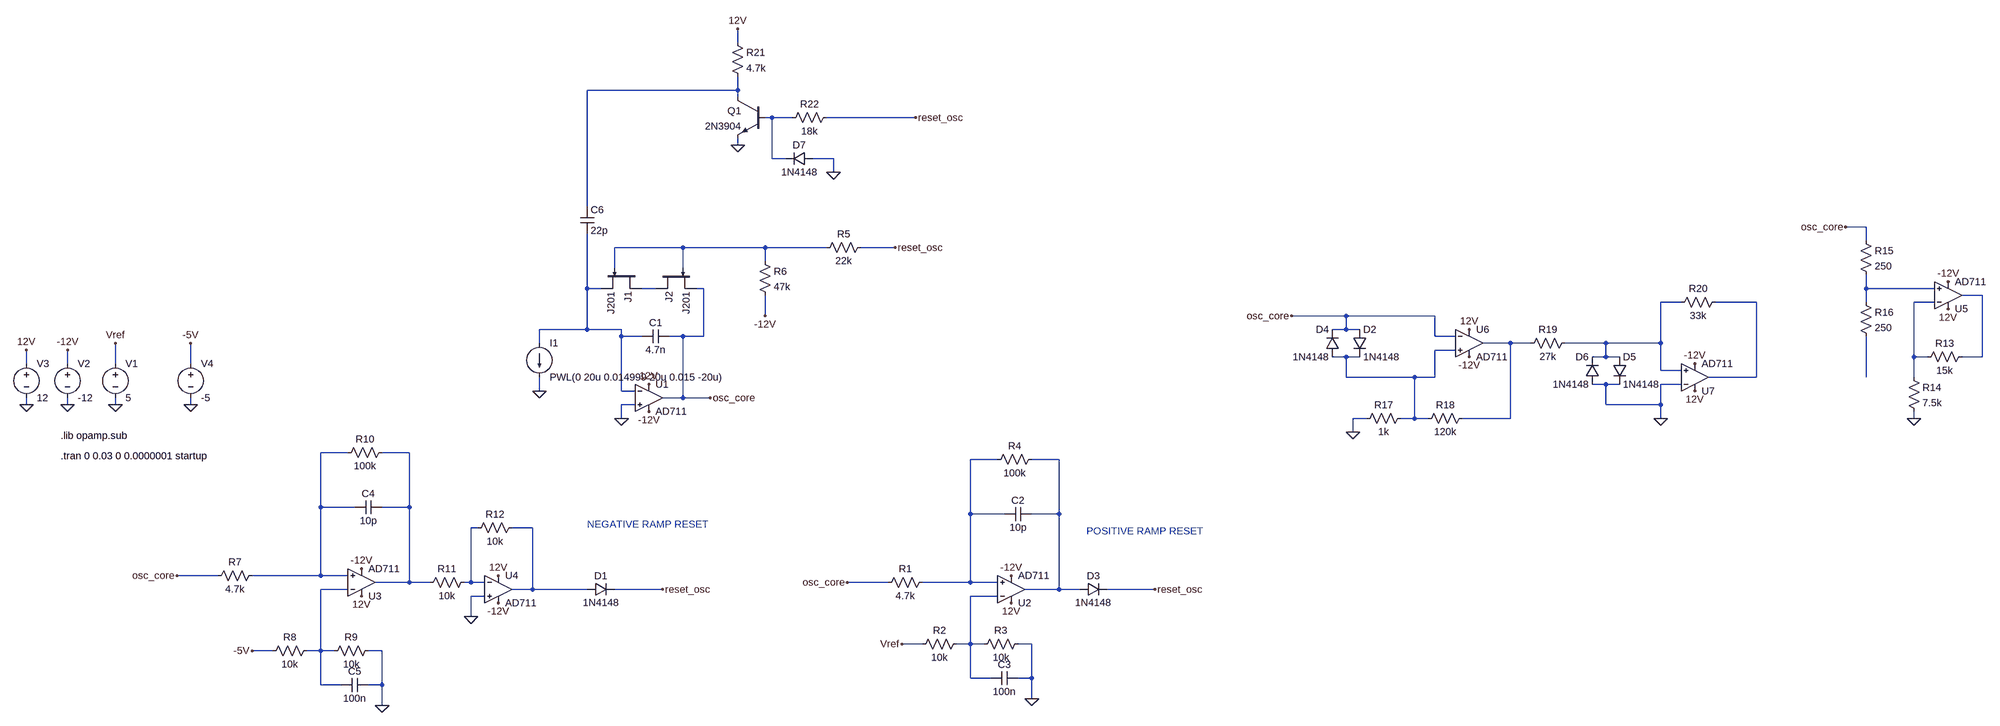
[diagram p0: schematic oscillator core.asc]
oscillator core.asc, the LTspice schematic file:
Version 4.1
SHEET 1 3296 1204
WIRE 208 -592 208 -624
WIRE 208 -480 208 -512
WIRE 208 -480 -144 -480
WIRE 208 -464 208 -480
WIRE 288 -416 272 -416
WIRE 336 -416 288 -416
WIRE 624 -416 416 -416
WIRE 208 -352 208 -368
WIRE 288 -320 288 -416
WIRE 320 -320 288 -320
WIRE 432 -320 384 -320
WIRE 432 -288 432 -320
WIRE -144 -208 -144 -480
WIRE 3008 -160 2960 -160
WIRE 3008 -128 3008 -160
WIRE 80 -112 -80 -112
WIRE 272 -112 80 -112
WIRE 416 -112 272 -112
WIRE 576 -112 496 -112
WIRE 272 -80 272 -112
WIRE -80 -64 -80 -112
WIRE 80 -64 80 -112
WIRE -144 -16 -144 -144
WIRE -112 -16 -144 -16
WIRE 16 -16 -16 -16
WIRE 128 -16 112 -16
WIRE 3008 -16 3008 -48
WIRE 3168 -16 3008 -16
WIRE 3280 0 3232 0
WIRE 2512 16 2464 16
WIRE 2688 16 2592 16
WIRE 3008 16 3008 -16
WIRE 3168 16 3120 16
WIRE 272 48 272 0
WIRE 1728 48 1600 48
WIRE 1936 48 1728 48
WIRE -144 80 -144 -16
WIRE -144 80 -256 80
WIRE -64 80 -144 80
WIRE 1728 80 1728 48
WIRE 1728 80 1696 80
WIRE 1760 80 1728 80
WIRE -64 96 -64 80
WIRE -16 96 -64 96
WIRE 80 96 48 96
WIRE 128 96 128 -16
WIRE 128 96 80 96
WIRE 1936 96 1936 48
WIRE 1984 96 1936 96
WIRE -256 112 -256 80
WIRE 2112 112 2048 112
WIRE 2160 112 2112 112
WIRE 2336 112 2240 112
WIRE 2464 112 2464 16
WIRE 2464 112 2336 112
WIRE 1984 128 1936 128
WIRE 1728 144 1696 144
WIRE 1760 144 1728 144
WIRE 2336 144 2336 112
WIRE 2336 144 2304 144
WIRE 2368 144 2336 144
WIRE 3120 144 3120 16
WIRE 3152 144 3120 144
WIRE 3280 144 3280 0
WIRE 3280 144 3232 144
WIRE -1456 160 -1456 128
WIRE -1360 160 -1360 128
WIRE -1248 160 -1248 112
WIRE -1072 160 -1072 112
WIRE 2464 176 2464 112
WIRE 2512 176 2464 176
WIRE 1728 192 1728 144
WIRE 1888 192 1728 192
WIRE 1936 192 1936 128
WIRE 1936 192 1888 192
WIRE 2688 192 2688 16
WIRE 2688 192 2576 192
WIRE 3008 192 3008 96
WIRE 3120 192 3120 144
WIRE 2336 208 2304 208
WIRE 2368 208 2336 208
WIRE 2512 208 2464 208
WIRE -256 224 -256 192
WIRE -64 224 -64 96
WIRE -32 224 -64 224
WIRE 80 240 80 96
WIRE 80 240 32 240
WIRE 144 240 80 240
WIRE -1456 256 -1456 240
WIRE -1360 256 -1360 240
WIRE -1248 256 -1248 240
WIRE -1072 256 -1072 240
WIRE -32 256 -64 256
WIRE 2336 256 2336 208
WIRE 2464 256 2464 208
WIRE 2464 256 2336 256
WIRE -64 288 -64 256
WIRE 1776 288 1744 288
WIRE 1888 288 1888 192
WIRE 1888 288 1856 288
WIRE 1920 288 1888 288
WIRE 2112 288 2112 112
WIRE 2112 288 2000 288
WIRE 2464 288 2464 256
WIRE 3120 288 3120 272
WIRE 1744 320 1744 288
WIRE -704 368 -768 368
WIRE -560 368 -624 368
WIRE 816 384 752 384
WIRE 960 384 896 384
WIRE -768 496 -768 368
WIRE -688 496 -768 496
WIRE -560 496 -560 368
WIRE -560 496 -624 496
WIRE 752 512 752 384
WIRE 832 512 752 512
WIRE 960 512 960 384
WIRE 960 512 896 512
WIRE -400 544 -416 544
WIRE -272 544 -320 544
WIRE -1008 656 -1104 656
WIRE -768 656 -768 496
WIRE -768 656 -928 656
WIRE -704 656 -768 656
WIRE -560 672 -560 496
WIRE -560 672 -640 672
WIRE -512 672 -560 672
WIRE -416 672 -416 544
WIRE -416 672 -432 672
WIRE -384 672 -416 672
WIRE 560 672 464 672
WIRE 752 672 752 512
WIRE 752 672 640 672
WIRE 816 672 752 672
WIRE -704 688 -768 688
WIRE -272 688 -272 544
WIRE -272 688 -320 688
WIRE -144 688 -272 688
WIRE 32 688 -80 688
WIRE 960 688 960 512
WIRE 960 688 880 688
WIRE 1008 688 960 688
WIRE 1184 688 1072 688
WIRE -384 704 -416 704
WIRE 816 704 752 704
WIRE -416 752 -416 704
WIRE 640 816 592 816
WIRE 752 816 752 704
WIRE 752 816 720 816
WIRE 784 816 752 816
WIRE 896 816 864 816
WIRE -880 832 -928 832
WIRE -768 832 -768 688
WIRE -768 832 -800 832
WIRE -736 832 -768 832
WIRE -624 832 -656 832
WIRE 752 896 752 816
WIRE 800 896 752 896
WIRE 896 896 896 816
WIRE 896 896 864 896
WIRE -768 912 -768 832
WIRE -720 912 -768 912
WIRE -624 912 -624 832
WIRE -624 912 -656 912
WIRE 896 944 896 896
WIRE -624 960 -624 912
FLAG -64 288 0
FLAG 0 272 -12V
FLAG 0 208 12V
FLAG 144 240 osc_core
FLAG -1248 256 0
FLAG -1248 112 Vref
FLAG -1456 256 0
FLAG -1360 256 0
FLAG -1456 128 12V
FLAG -1360 128 -12V
FLAG -256 224 0
FLAG -1072 256 0
FLAG -1072 112 -5V
FLAG 272 48 -12V
FLAG 848 656 -12V
FLAG 848 720 12V
FLAG 464 672 osc_core
FLAG 896 944 0
FLAG 592 816 Vref
FLAG -672 640 -12V
FLAG -672 704 12V
FLAG -624 960 0
FLAG -928 832 -5V
FLAG -1104 656 osc_core
FLAG 32 688 reset_osc
FLAG 1184 688 reset_osc
FLAG -352 720 -12V
FLAG -352 656 12V
FLAG -416 752 0
FLAG 3200 -32 -12V
FLAG 3200 32 12V
FLAG 3120 288 0
FLAG 2016 144 -12V
FLAG 2016 80 12V
FLAG 1744 320 0
FLAG 1600 48 osc_core
FLAG 2960 -160 osc_core
FLAG 2544 160 -12V
FLAG 2544 224 12V
FLAG 2464 288 0
FLAG 208 -352 0
FLAG 208 -624 12V
FLAG 432 -288 0
FLAG 576 -112 reset_osc
FLAG 624 -416 reset_osc
SYMBOL cap 48 80 R90
WINDOW 0 0 32 VBottom 2
WINDOW 3 32 32 VTop 2
SYMATTR InstName C1
SYMATTR Value 4.7n
SYMBOL res 512 -128 R90
WINDOW 0 0 56 VBottom 2
WINDOW 3 32 56 VTop 2
SYMATTR InstName R5
SYMATTR Value 22k
SYMBOL OpAmps\\AD711 0 176 R0
SYMATTR InstName U1
SYMBOL res 256 -96 R0
SYMATTR InstName R6
SYMATTR Value 47k
SYMBOL voltage -1248 144 R0
WINDOW 123 0 0 Left 0
WINDOW 39 0 0 Left 0
SYMATTR InstName V1
SYMATTR Value 5
SYMBOL voltage -1360 144 R0
WINDOW 123 0 0 Left 0
WINDOW 39 0 0 Left 0
SYMATTR InstName V2
SYMATTR Value -12
SYMBOL voltage -1456 144 R0
WINDOW 123 0 0 Left 0
WINDOW 39 0 0 Left 0
SYMATTR InstName V3
SYMATTR Value 12
SYMBOL current -256 112 R0
WINDOW 123 0 0 Left 0
WINDOW 39 0 0 Left 0
SYMATTR InstName I1
SYMATTR Value PWL(0 20u 0.014999 20u 0.015 -20u)
SYMBOL voltage -1072 144 R0
WINDOW 123 0 0 Left 0
WINDOW 39 0 0 Left 0
SYMATTR InstName V4
SYMATTR Value -5
SYMBOL njf -16 -64 R90
SYMATTR InstName J1
SYMATTR Value J201
SYMBOL njf 16 -64 M90
SYMATTR InstName J2
SYMATTR Value J201
SYMBOL res 656 656 R90
WINDOW 0 0 56 VBottom 2
WINDOW 3 32 56 VTop 2
SYMATTR InstName R1
SYMATTR Value 4.7k
SYMBOL OpAmps\\AD711 848 752 M180
SYMATTR InstName U2
SYMBOL cap 896 496 R90
WINDOW 0 0 32 VBottom 2
WINDOW 3 32 32 VTop 2
SYMATTR InstName C2
SYMATTR Value 10p
SYMBOL diode 1008 704 R270
WINDOW 0 32 32 VTop 2
WINDOW 3 0 32 VBottom 2
SYMATTR InstName D3
SYMATTR Value 1N4148
SYMBOL res 736 800 R90
WINDOW 0 0 56 VBottom 2
WINDOW 3 32 56 VTop 2
SYMATTR InstName R2
SYMATTR Value 10k
SYMBOL res 880 800 R90
WINDOW 0 0 56 VBottom 2
WINDOW 3 32 56 VTop 2
SYMATTR InstName R3
SYMATTR Value 10k
SYMBOL cap 864 880 R90
WINDOW 0 0 32 VBottom 2
WINDOW 3 32 32 VTop 2
SYMATTR InstName C3
SYMATTR Value 100n
SYMBOL res 912 368 R90
WINDOW 0 0 56 VBottom 2
WINDOW 3 32 56 VTop 2
SYMATTR InstName R4
SYMATTR Value 100k
SYMBOL res -912 640 R90
WINDOW 0 0 56 VBottom 2
WINDOW 3 32 56 VTop 2
SYMATTR InstName R7
SYMATTR Value 4.7k
SYMBOL OpAmps\\AD711 -672 736 M180
SYMATTR InstName U3
SYMBOL cap -624 480 R90
WINDOW 0 0 32 VBottom 2
WINDOW 3 32 32 VTop 2
SYMATTR InstName C4
SYMATTR Value 10p
SYMBOL diode -144 704 R270
WINDOW 0 32 32 VTop 2
WINDOW 3 0 32 VBottom 2
SYMATTR InstName D1
SYMATTR Value 1N4148
SYMBOL res -784 816 R90
WINDOW 0 0 56 VBottom 2
WINDOW 3 32 56 VTop 2
SYMATTR InstName R8
SYMATTR Value 10k
SYMBOL res -640 816 R90
WINDOW 0 0 56 VBottom 2
WINDOW 3 32 56 VTop 2
SYMATTR InstName R9
SYMATTR Value 10k
SYMBOL cap -656 896 R90
WINDOW 0 0 32 VBottom 2
WINDOW 3 32 32 VTop 2
SYMATTR InstName C5
SYMATTR Value 100n
SYMBOL res -608 352 R90
WINDOW 0 0 56 VBottom 2
WINDOW 3 32 56 VTop 2
SYMATTR InstName R10
SYMATTR Value 100k
SYMBOL OpAmps\\AD711 -352 624 R0
SYMATTR InstName U4
SYMBOL res -416 656 R90
WINDOW 0 0 56 VBottom 2
WINDOW 3 32 56 VTop 2
SYMATTR InstName R11
SYMATTR Value 10k
SYMBOL res -304 528 R90
WINDOW 0 0 56 VBottom 2
WINDOW 3 32 56 VTop 2
SYMATTR InstName R12
SYMATTR Value 10k
SYMBOL OpAmps\\AD711 3200 64 M180
SYMATTR InstName U5
SYMBOL res 3248 128 R90
WINDOW 0 0 56 VBottom 2
WINDOW 3 32 56 VTop 2
SYMATTR InstName R13
SYMATTR Value 15k
SYMBOL res 3104 176 R0
SYMATTR InstName R14
SYMATTR Value 7.5k
SYMBOL res 2992 -144 R0
SYMATTR InstName R15
SYMATTR Value 250
SYMBOL res 2992 0 R0
SYMATTR InstName R16
SYMATTR Value 250
SYMBOL OpAmps\\AD711 2016 48 R0
SYMATTR InstName U6
SYMBOL diode 1744 80 R0
SYMATTR InstName D2
SYMATTR Value 1N4148
SYMBOL diode 1712 144 R180
WINDOW 0 24 64 Left 2
WINDOW 3 24 0 Left 2
SYMATTR InstName D4
SYMATTR Value 1N4148
SYMBOL res 1872 272 R90
WINDOW 0 0 56 VBottom 2
WINDOW 3 32 56 VTop 2
SYMATTR InstName R17
SYMATTR Value 1k
SYMBOL res 2016 272 R90
WINDOW 0 0 56 VBottom 2
WINDOW 3 32 56 VTop 2
SYMATTR InstName R18
SYMATTR Value 120k
SYMBOL res 2256 96 R90
WINDOW 0 0 56 VBottom 2
WINDOW 3 32 56 VTop 2
SYMATTR InstName R19
SYMATTR Value 27k
SYMBOL diode 2352 144 R0
SYMATTR InstName D5
SYMATTR Value 1N4148
SYMBOL diode 2320 208 R180
WINDOW 0 24 64 Left 2
WINDOW 3 24 0 Left 2
SYMATTR InstName D6
SYMATTR Value 1N4148
SYMBOL OpAmps\\AD711 2544 256 M180
SYMATTR InstName U7
SYMBOL res 2608 0 R90
WINDOW 0 0 56 VBottom 2
WINDOW 3 32 56 VTop 2
SYMATTR InstName R20
SYMATTR Value 33k
SYMBOL cap -160 -208 R0
SYMATTR InstName C6
SYMATTR Value 22p
SYMBOL res 192 -608 R0
SYMATTR InstName R21
SYMATTR Value 4.7k
SYMBOL npn 272 -464 M0
SYMATTR InstName Q1
SYMATTR Value 2N3904
SYMBOL res 432 -432 R90
WINDOW 0 0 56 VBottom 2
WINDOW 3 32 56 VTop 2
SYMATTR InstName R22
SYMATTR Value 18k
SYMBOL diode 384 -336 R90
WINDOW 0 0 32 VBottom 2
WINDOW 3 32 32 VTop 2
SYMATTR InstName D7
SYMATTR Value 1N4148
TEXT -1376 376 Left 2 !.tran 0 0.03 0 0.0000001 startup
TEXT -1376 328 Left 2 !.lib opamp.sub
TEXT 1024 552 Left 2 ;POSITIVE RAMP RESET
TEXT -144 536 Left 2 ;NEGATIVE RAMP RESET

The netlist it stands for:
* oscillator core.asc
C1 osc_core N004 4.7n
R5 reset_osc N003 22k
X§U1 0 N004 12V -12V osc_core AD712  ; AD711, pins In+ In- V+ V- OUT
R6 N003 -12V 47k
V1 Vref 0 5
V2 -12V 0 -12
V3 12V 0 12
I1 N004 0 PWL(0 20u 0.014999 20u 0.015 -20u)
V4 -5V 0 -5
J1 N005 N003 N004 J201
J2 N005 N003 osc_core J201
R1 N016 osc_core 4.7k
X§U2 N016 N021 12V -12V N017 AD712  ; AD711, pins In+ In- V+ V- OUT
C2 N017 N016 10p
D3 N017 reset_osc 1N4148
R2 N021 Vref 10k
R3 0 N021 10k
C3 0 N021 100n
R4 N017 N016 100k
R7 N014 osc_core 4.7k
X§U3 N014 N020 12V -12V N015 AD712  ; AD711, pins In+ In- V+ V- OUT
C4 N015 N014 10p
D1 N019 reset_osc 1N4148
R8 N020 -5V 10k
R9 0 N020 10k
C5 0 N020 100n
R10 N015 N014 100k
X§U4 0 N018 12V -12V N019 AD712  ; AD711, pins In+ In- V+ V- OUT
R11 N018 N015 10k
R12 N019 N018 10k
X§U5 N006 N010 12V -12V N007 AD712  ; AD711, pins In+ In- V+ V- OUT
R13 N007 N010 15k
R14 N010 0 7.5k
R15 osc_core N006 250
R16 N006 N013 250
X§U6 N012 osc_core 12V -12V N011 AD712  ; AD711, pins In+ In- V+ V- OUT
D2 osc_core N012 1N4148
D4 N012 osc_core 1N4148
R17 N012 0 1k
R18 N011 N012 120k
R19 N008 N011 27k
D5 N008 0 1N4148
D6 0 N008 1N4148
X§U7 N008 0 12V -12V N009 AD712  ; AD711, pins In+ In- V+ V- OUT
R20 N009 N008 33k
C6 N001 N004 22p
R21 12V N001 4.7k
Q1 N001 N002 0 0 2N3904
R22 reset_osc N002 18k
D7 0 N002 1N4148
.model D D
.lib standard.dio
.model NPN NPN
.model PNP PNP
.lib standard.bjt
.model NJF NJF
.model PJF PJF
.lib standard.jft
.tran 0 0.03 0 0.0000001 startup
.lib opamp.sub
* POSITIVE RAMP RESET
* NEGATIVE RAMP RESET
.lib ADI1.lib
.backanno
.end